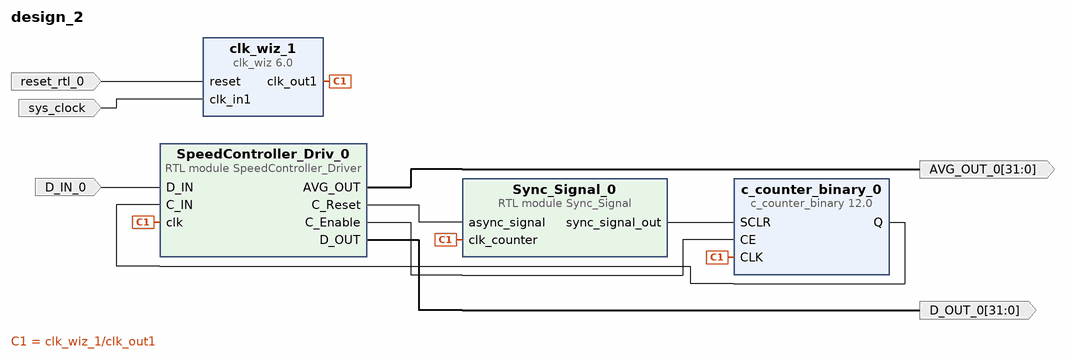
[diagram p0: block diagram of the top level]
# Vivado block design design_2, xc7z020clg400-1, Vivado 2024.1
create_bd_design design_2

create_bd_port -dir O -from 31 -to 0 AVG_OUT_0
create_bd_port -dir O -from 31 -to 0 D_OUT_0
create_bd_port -dir I -type clk sys_clock
set_property -dict {CONFIG.FREQ_HZ 125000000 CONFIG.PHASE 0.0} [get_bd_ports sys_clock]
create_bd_port -dir I -type rst reset_rtl_0
set_property -dict {CONFIG.POLARITY ACTIVE_HIGH} [get_bd_ports reset_rtl_0]
create_bd_port -dir I D_IN_0

create_bd_cell -type module -reference SpeedController_Driver SpeedController_Driv_0
create_bd_cell -type module -reference Sync_Signal Sync_Signal_0
create_bd_cell -type ip -vlnv xilinx.com:ip:c_counter_binary:12.0 c_counter_binary_0
set_property -dict {CONFIG.CE true CONFIG.Load false CONFIG.Output_Width 32 CONFIG.SCLR true} [get_bd_cells c_counter_binary_0]
create_bd_cell -type ip -vlnv xilinx.com:ip:clk_wiz:6.0 clk_wiz_1
set_property -dict [list \
  CONFIG.CLKOUT1_REQUESTED_OUT_FREQ 100 \
  CONFIG.CLK_IN1_BOARD_INTERFACE sys_clock \
  CONFIG.USE_BOARD_FLOW true \
] [get_bd_cells clk_wiz_1]

# ---- connections ----

connect_bd_net -net D_IN_0_1 [get_bd_ports D_IN_0] [get_bd_pins SpeedController_Driv_0/D_IN]
connect_bd_net [get_bd_pins SpeedController_Driv_0/AVG_OUT] [get_bd_ports AVG_OUT_0]
connect_bd_net [get_bd_pins SpeedController_Driv_0/C_Enable] [get_bd_pins c_counter_binary_0/CE]
connect_bd_net [get_bd_pins SpeedController_Driv_0/C_Reset] [get_bd_pins Sync_Signal_0/async_signal]
connect_bd_net [get_bd_pins SpeedController_Driv_0/D_OUT] [get_bd_ports D_OUT_0]
connect_bd_net [get_bd_pins Sync_Signal_0/sync_signal_out] [get_bd_pins c_counter_binary_0/SCLR]
connect_bd_net [get_bd_pins c_counter_binary_0/Q] [get_bd_pins SpeedController_Driv_0/C_IN]
connect_bd_net [get_bd_pins clk_wiz_1/clk_out1] \
  [get_bd_pins c_counter_binary_0/CLK] [get_bd_pins Sync_Signal_0/clk_counter] [get_bd_pins SpeedController_Driv_0/clk]
connect_bd_net -net reset_rtl_0_1 [get_bd_ports reset_rtl_0] [get_bd_pins clk_wiz_1/reset]
connect_bd_net [get_bd_ports sys_clock] [get_bd_pins clk_wiz_1/clk_in1]

validate_bd_design
save_bd_design
